# Altium schematic sheet CODEC0.SchDoc: CODEC 0
size A3; Date: 2011-11-28; Author: S.Choquette; Revision: 2.0; SheetNumber: 6; SheetTotal: 9
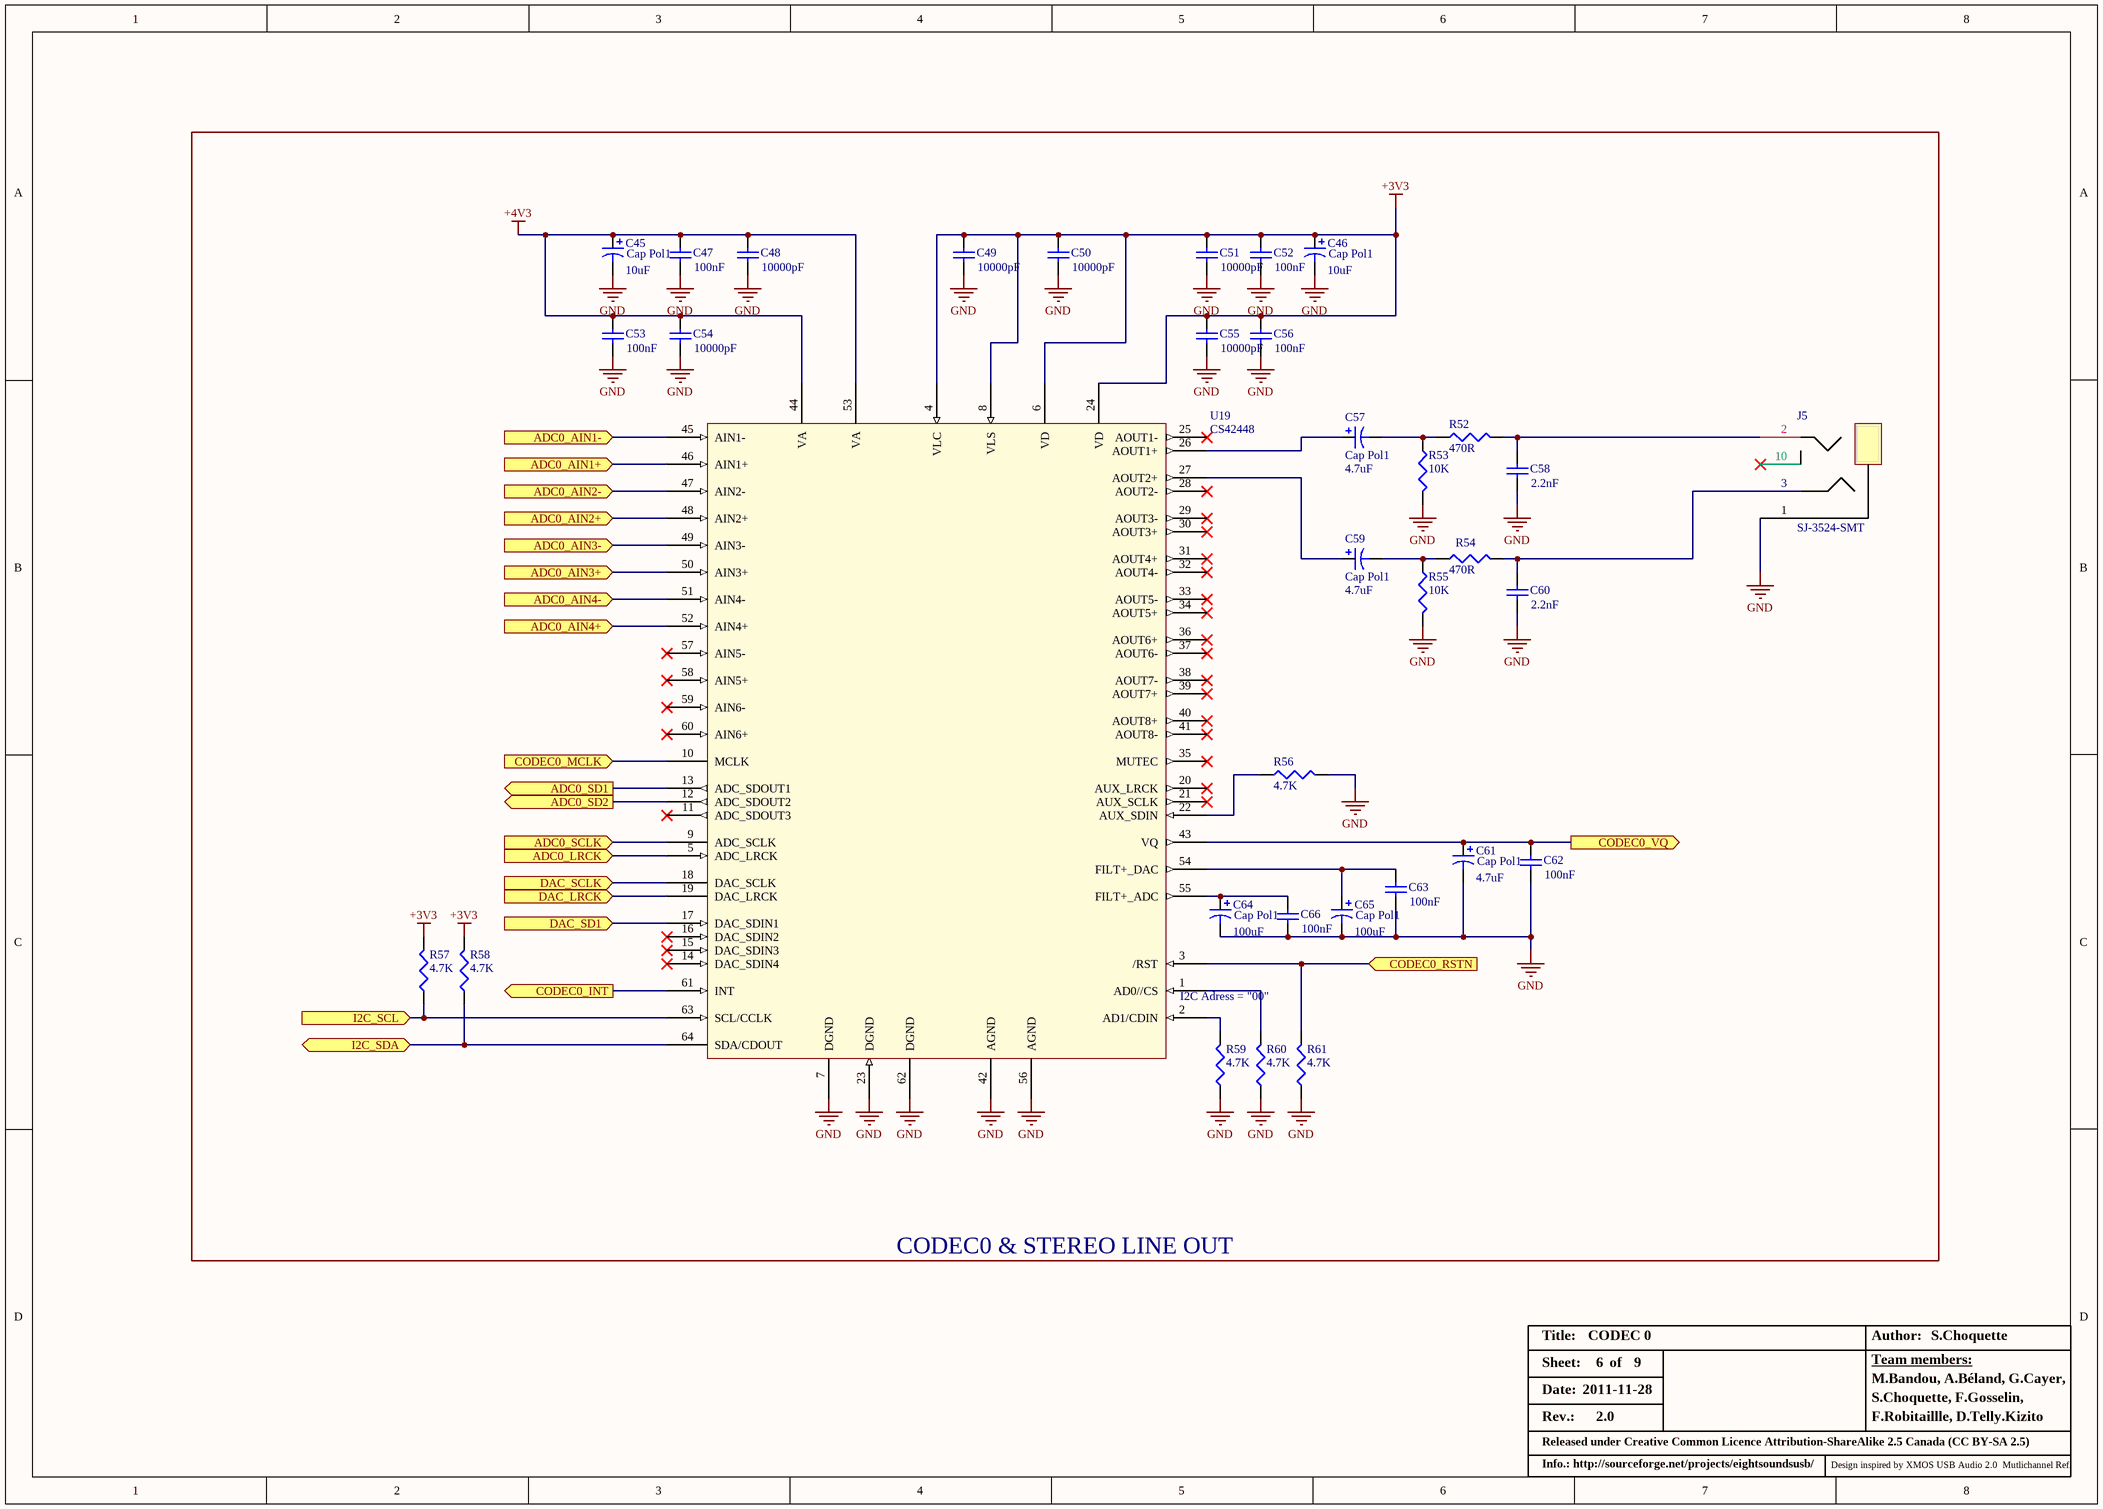
[diagram p0: CODEC0.SchDoc]

## Parts
C45  Cap Pol1  value 10uF  [AL_ELEC_SMD_B]
C46  Cap Pol1  value 10uF  [AL_ELEC_SMD_B]
C47  value 100nF  [2-0402]
C48  value 10000pF  [2-0402]
C49  value 10000pF  [2-0402]
C50  value 10000pF  [2-0402]
C51  value 10000pF  [2-0402]
C52  value 100nF  [2-0402]
C53  value 100nF  [2-0402]
C54  value 10000pF  [2-0402]
C55  value 10000pF  [2-0402]
C56  value 100nF  [2-0402]
C57  Cap Pol1  value 4.7uF  [AL_ELEC_SMD_B]
C58  value 2.2nF  [3-0603]
C59  Cap Pol1  value 4.7uF  [AL_ELEC_SMD_B]
C60  value 2.2nF  [3-0603]
C61  Cap Pol1  value 4.7uF  [AL_ELEC_SMD_B]
C62  value 100nF  [2-0402]
C63  value 100nF  [2-0402]
C64  Cap Pol1  value 100uF  [AL_ELEC_SMD_D]
C65  Cap Pol1  value 100uF  [AL_ELEC_SMD_D]
C66  value 100nF  [2-0402]
J5  SJ-3524-SMT  [SJ-3524-SMT]
R52  value 470R  [3-0603]
R53  value 10K  [3-0603]
R54  value 470R  [3-0603]
R55  value 10K  [3-0603]
R56  value 4.7K  [3-0603]
R57  value 4.7K  [3-0603]
R58  value 4.7K  [3-0603]
R59  value 4.7K  [3-0603]
R60  value 4.7K  [3-0603]
R61  value 4.7K  [3-0603]
U19  CS42448  [QFN50P1200X1200-64V1L-MOD]

## Ports
ADC0_AIN1+ (in), ADC0_AIN1- (in), ADC0_AIN2+ (in), ADC0_AIN2- (in), ADC0_AIN3+ (in), ADC0_AIN3- (in), ADC0_AIN4+ (in), ADC0_AIN4- (in), ADC0_LRCK (in), ADC0_SCLK (in), ADC0_SD1 (out), ADC0_SD2 (out), CODEC0_INT (out), CODEC0_MCLK (in), CODEC0_RSTN (in), CODEC0_VQ (out), DAC_LRCK (in), DAC_SCLK (in), DAC_SD1 (in), I2C_SCL (in), I2C_SDA (bidir)

## Nets
+3V3: C46.1 C49.2 C50.2 C51.2 C52.2 C55.2 C56.2 R57.2 R58.2 U19.4(VLC) U19.6(VD) U19.8(VLS) U19.24(VD)
+4V3: C45.1 C47.2 C48.2 C53.2 C54.2 U19.44(VA) U19.53(VA)
GND: C45.2 C46.2 C47.1 C48.1 C49.1 C50.1 C51.1 C52.1 C53.1 C54.1 C55.1 C56.1 C58.1 C60.1 C61.2 C62.1 C63.1 C64.2 C65.2 C66.1 J5.1(GND) R53.2 R55.2 R56.2 R59.1 R60.1 R61.1 U19.7(DGND) U19.23(DGND) U19.42(AGND) U19.56(AGND) U19.62(DGND)
ADC0_AIN1+: U19.46(AIN1+) ; port ADC0_AIN1+
ADC0_AIN1-: U19.45(AIN1-) ; port ADC0_AIN1-
ADC0_AIN2+: U19.48(AIN2+) ; port ADC0_AIN2+
ADC0_AIN2-: U19.47(AIN2-) ; port ADC0_AIN2-
ADC0_AIN3+: U19.50(AIN3+) ; port ADC0_AIN3+
ADC0_AIN3-: U19.49(AIN3-) ; port ADC0_AIN3-
ADC0_AIN4+: U19.52(AIN4+) ; port ADC0_AIN4+
ADC0_AIN4-: U19.51(AIN4-) ; port ADC0_AIN4-
ADC0_LRCK: U19.5(ADC_LRCK) ; port ADC0_LRCK
ADC0_SCLK: U19.9(ADC_SCLK) ; port ADC0_SCLK
ADC0_SD1: U19.13(ADC_SDOUT1) ; port ADC0_SD1
ADC0_SD2: U19.12(ADC_SDOUT2) ; port ADC0_SD2
CODEC0_INT: U19.61(INT) ; port CODEC0_INT
CODEC0_MCLK: U19.10(MCLK) ; port CODEC0_MCLK
CODEC0_RSTN: R61.2 U19.3(/RST) ; port CODEC0_RSTN
CODEC0_VQ: C61.1 C62.2 U19.43(VQ) ; port CODEC0_VQ
DAC_LRCK: U19.19(DAC_LRCK) ; port DAC_LRCK
DAC_SCLK: U19.18(DAC_SCLK) ; port DAC_SCLK
DAC_SD1: U19.17(DAC_SDIN1) ; port DAC_SD1
I2C_SCL: R57.1 U19.63(SCL/CCLK) ; port I2C_SCL
I2C_SDA: R58.1 U19.64(SDA/CDOUT) ; port I2C_SDA
NetC57_1: C57.1 U19.26(AOUT1+)
NetC57_2: C57.2 R52.1 R53.1
NetC58_2: C58.2 J5.2(AIN2P) R52.2
NetC59_1: C59.1 U19.27(AOUT2+)
NetC59_2: C59.2 R54.1 R55.1
NetC60_2: C60.2 J5.3(AIN1P) R54.2
NetC63_2: C63.2 C65.1 U19.54(FILT+_DAC)
NetC64_1: C64.1 C66.2 U19.55(FILT+_ADC)
NetR56_1: R56.1 U19.22(AUX_SDIN)
NetR59_2: R59.2 U19.2(AD1/CDIN)
NetR60_2: R60.2 U19.1(AD0//CS)

Not connected (* = marked no-connect by the designer): J5 10(NC)*; U19 11(ADC_SDOUT3)* 14(DAC_SDIN4)* 15(DAC_SDIN3)* 16(DAC_SDIN2)* 20(AUX_LRCK)* 21(AUX_SCLK)* 25(AOUT1-)* 28(AOUT2-)* 29(AOUT3-)* 30(AOUT3+)* 31(AOUT4+)* 32(AOUT4-)* 33(AOUT5-)* 34(AOUT5+)* 35(MUTEC)* 36(AOUT6+)* 37(AOUT6-)* 38(AOUT7-)* 39(AOUT7+)* 40(AOUT8+)* 41(AOUT8-)* 57(AIN5-)* 58(AIN5+)* 59(AIN6-)* 60(AIN6+)*

## Notes on the sheet
- (near U19) I2C Adress = "00"
- CODEC0 & STEREO LINE OUT
- Title:
- Date:
- Sheet:
- of
- Author:
- Team members:
- M.Bandou, A.Béland, G.Cayer,
- Rev.:
- Released under Creative Common Licence Attribution-ShareAlike 2.5 Canada (CC BY-SA 2.5)
- S.Choquette, F.Gosselin,
- F.Robitaillle, D.Telly.Kizito
- Info.: http://sourceforge.net/projects/eightsoundsusb/
- Design inspired by XMOS USB Audio 2.0  Mutlichannel Ref.

## Library data of the parts
C45 C46 = Cap Pol1: Al Elec 10uF CaseB 16V; Manufacturer: Panasonic; Part Number: EEEFK1C100R; Cost: *
C47 C52 C53 C56 C62 C63 C66 = Cap: MLCC 100nF 0402 X7R 16V; Manufacturer: Murata; Part Number: GRM155R71C104KA88; Cost: 0,005
C48-C51 C54 C55 = Cap: MLCC 10000pF 0402 X7R 25V; Manufacturer: Murata; Part Number: GRM155R71E103KA01D; Cost: 0,005
C57 C59 C61 = Cap Pol1: Al Elec 4.7uF CaseB 35V; Manufacturer: Panasonic; Part Number: EEEFK1V4R7R; Cost: *
C58 C60 = Cap: MLCC 2.2uF 0603 X5R 10V; Manufacturer: Murata; Part Number: GRM1885C1H222JA01; Cost: 0,005
C64 C65 = Cap Pol1: Al Elec 100uF CaseD 16V; Manufacturer: Panasonic; Part Number: EEEFK1C101P; Cost: *
J5 = SJ-3524-SMT: Stereo Jack 1/8 in, 3.5 mm; Manufacturer: CUI Inc; Part Number: SJ-3524-SMT
R52 R54 = Res3: RES 470R 0603 1%; Manufacturer: ROHM; Part Number: MCR03EZPFX4700; Cost: *
R53 R55 = Res3: RES 10k 0603 1%; Manufacturer: ROHM; Part Number: MCR03EZPFX1002; Cost: *
R56-R61 = Res3: RES 4.7k 0603 1%; Manufacturer: ROHM; Part Number: MCR03EZPFX4701; Cost: *
U19 = CS42448: 108 dB, 192 kHz 6-in, 8-out Multi-Channel Codec; Manufacturer: Cirrus Logic; Part Number: CS42448